# EAGLE schematic semaforo (EAGLE 6.5.0)
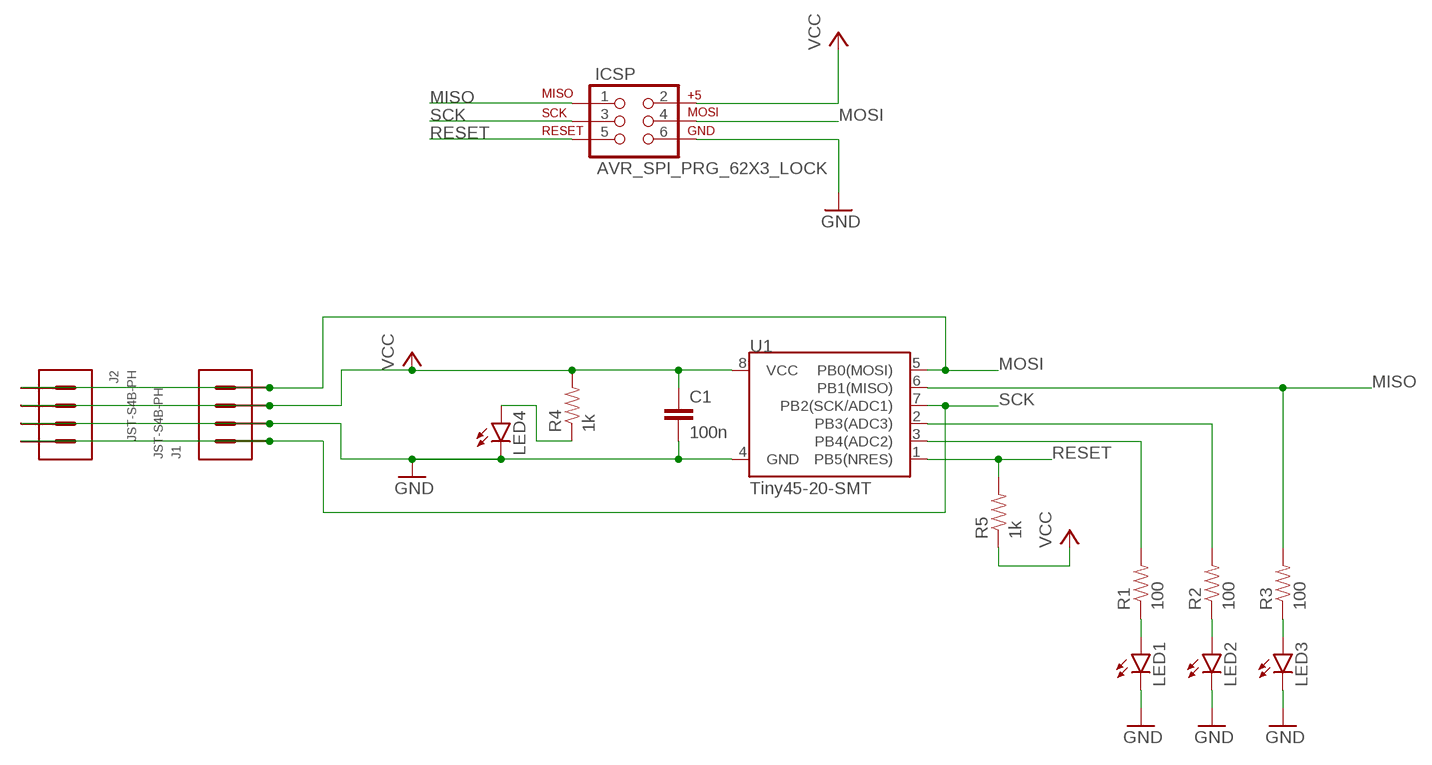
[diagram p0: schematic, sheet 1]

## Parts
C1  100n  CAP1206  [1206]
ICSP  AVR_SPI_PRG_62X3_LOCK  [2X3_LOCK]
J1  JST-S4B-PH  [JST-S4B-PH]
J2  JST-S4B-PH  [JST-S4B-PH]
LED1  LED5MM  [LED5MM]
LED2  LED5MM  [LED5MM]
LED3  LED5MM  [LED5MM]
LED4  LED1206  [LED-1206]
R1  100  RESISTOR1206  [1206]
R2  100  RESISTOR1206  [1206]
R3  100  RESISTOR1206  [1206]
R4  1k  RESISTOR1206  [1206]
R5  1k  RESISTOR1206  [1206]
U1  Tiny45-20-SMT  ATTINY45TINY45-20-SMT  [SO08-EIAJ]

## Nets
GND: C1.2 ICSP.6 J1.P$2 J2.P$3 LED1.K(C) LED2.K(C) LED3.K(C) LED4.C U1.4(GND)
MISO: ICSP.1 R3.2 U1.6(PB1(MISO))
MOSI: ICSP.4 J1.P$4 J2.P$1 U1.5(PB0(MOSI))
N$5: R1.2 U1.3(PB4(ADC2))
N$6: R2.2 U1.2(PB3(ADC3))
N$8: LED4.A R4.1
N$10: LED1.A R1.1
N$12: LED2.A R2.1
N$13: LED3.A R3.1
RESET: ICSP.5 R5.2 U1.1(PB5(NRES))
SCK: ICSP.3 J1.P$1 J2.P$4 U1.7(PB2(SCK/ADC1))
VCC: C1.1 ICSP.2 J1.P$3 J2.P$2 R4.2 R5.1 U1.8(VCC)

## Library data of the parts
C1 = SparkFun-Capacitors:CAP: Capacitor Standard 0603 ceramic capacitor, and 0.1" leaded capacitor.
ICSP = SparkFun-Connectors:AVR_SPI_PRG_6: AVR ISP 6 Pin This is the reduced ISP connector for AVR programming. Common on Arduino. This footprint will take up less PCB space and can be used with a 10-pin to 6-pin adapter such as SKU: BOB-08508 **Special note about "TEST_POINT" package. The stop mask is on the top side, so if you want your programming test points to be on the bottom of your board, make sure to place this package on the bottom side of the board. This also ensure that the orientation to program from the bottom side will be correct.
J1 J2 = jst-ph:JST-S4B-PH
LED1-LED4 = SparkFun-LED:LED: LEDs Standard schematic elements and footprints for 5mm, 3mm, 1206, and 0603 sized LEDs. 5mm - Spark Fun Electronics SKU : COM-00529 (and others)
R1-R5 = SparkFun-Passives:RESISTOR: Resistor Basic schematic elements and footprints for 0603, 1206, and PTH resistors.
U1 = SparkFun-DigitalIC:ATTINY45: Atmel 8-pin 2/4/8kB flash uC; PROD_ID: IC-08922